# EAGLE design MotorDriver (EAGLE 7.3.0)
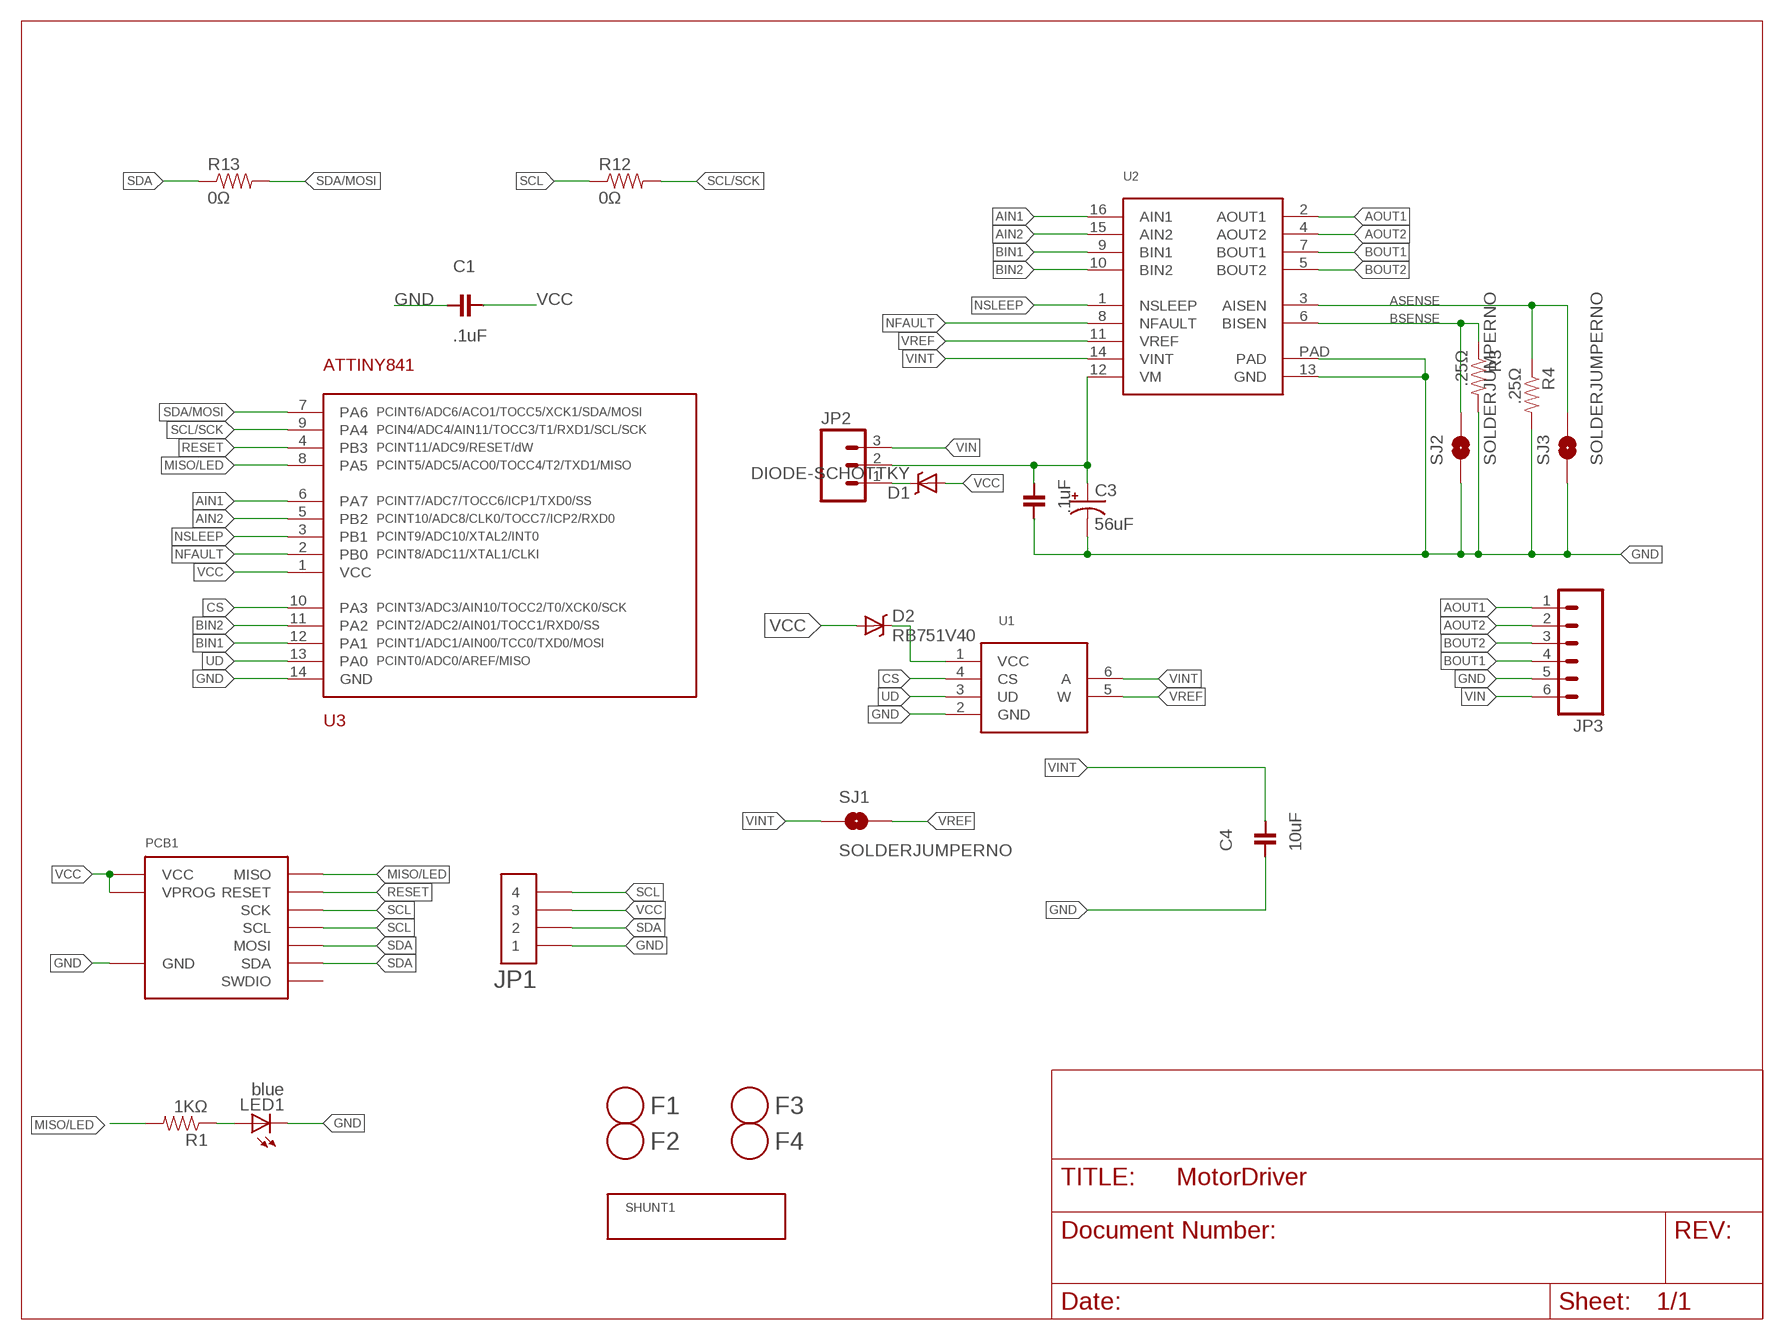
[diagram p0: schematic, sheet 1]
FRAME1 (LETTER_L): BOM: EXCLUDE
SHUNT1 (BOM_ITEM): PARTNUM: SPC02SYAN

## Parts
C1  .1uF  CAPACITOR-.1UF  [0603]
C2  .1uF  CAPACITOR-.1UF  [0603]
C3  56uF  CAPACITOR-POL-56UF-25V  [PANASONIC_D]
C4  10uF  CAPACITOR-10UF  [0603]
D1  DIODE-SCHOTTKY  [SMP]
D2  RB751V40  DIODE-SCHOTTKY-BAT60A  [SOD-323]
F1  FIDUCIAL  [FIDUCIAL_1MM]
F2  FIDUCIAL  [FIDUCIAL_1MM]
F3  FIDUCIAL  [FIDUCIAL_1MM]
F4  FIDUCIAL  [FIDUCIAL_1MM]
JP1  HEADER-1X4-AMPMODU  [AMPMODU-4P]
JP2  M03LOCK_NO_SILK  [1X03_LOCK_NO_SILK]
JP3  M063.5MM-6  [SCREWTERMINAL-3.5MM-6]
LED1  blue  LED-0805-BLUE  [0805-LED]
PCB1  DEVICE-PCB  [DEVICE-PCB]
R1  1KΩ  RESISTOR-1KΩ  [0603]
R3  .25Ω  RESISTOR2010  [R2010]
R4  .25Ω  RESISTOR2010  [R2010]
R12  0Ω  RESISTOR-0Ω  [0603]
R13  0Ω  RESISTOR-0Ω  [0603]
SJ1  SOLDERJUMPERNO  [SJ_2S-NO]
SJ2  SOLDERJUMPERNO  [SJ_2S-NO]
SJ3  SOLDERJUMPERNO  [SJ_2S-NO]
U1  MCP4013  [SOT-23-6]
U2  DRV8848  [HTSSOP-16]
U3  ATTINY841  [SOIC-14]

## Nets
AIN1: U2.16(AIN1) U3.6(PA7)
AIN2: U2.15(AIN2) U3.5(PB2)
AOUT1: JP3.1 U2.2(AOUT1)
AOUT2: JP3.2 U2.4(AOUT2)
ASENSE: R4.1 SJ3.2 U2.3(AISEN)
BIN1: U2.9(BIN1) U3.12(PA1)
BIN2: U2.10(BIN2) U3.11(PA2)
BOUT1: JP3.4 U2.7(BOUT1)
BOUT2: JP3.3 U2.5(BOUT2)
BSENSE: R3.1 SJ2.2 U2.6(BISEN)
CS: U1.4(CS) U3.10(PA3)
GND: C1.2 C2.2 C3.- C4.2 JP1.P$1 JP1.P$2 JP3.5 LED1.C PCB1.GND R3.2 R4.2 SJ2.1 SJ3.1 U1.2(GND) U2.13(GND) U2.PAD U3.14(GND)
MISO/LED: PCB1.MISO R1.2 U3.8(PA5)
N$1: D1.C JP2.1
N$2: D2.C U1.1(VCC)
N$7: LED1.A R1.1
N$10: C2.1 C3.+ JP2.2 U2.12(VM)
NFAULT: U2.8(NFAULT) U3.2(PB0)
NSLEEP: U2.1(NSLEEP) U3.3(PB1)
RESET: PCB1.RESET U3.4(PB3)
SCL: JP1.P$7 JP1.P$8 PCB1.CLK(SCK) PCB1.SCL R12.1
SCL/SCK: R12.2 U3.9(PA4)
SDA: JP1.P$3 JP1.P$4 PCB1.MOSI PCB1.SDA R13.1
SDA/MOSI: R13.2 U3.7(PA6)
UD: U1.3(UD) U3.13(PA0)
VCC: C1.1 D1.A D2.A JP1.P$5 JP1.P$6 PCB1.VCC PCB1.VPROG U3.1(VCC)
VIN: JP2.3 JP3.6
VINT: C4.1 SJ1.1 U1.6(A) U2.14(VINT)
VREF: SJ1.2 U1.5(W) U2.11(VREF)
Unconnected: PCB1.SWDIO

## Library data of the parts
C1 = Modulo:CAPACITOR: Capacitor; PARTNUM: C0603C104K5RACTU
C2 = Modulo:CAPACITOR: Capacitor; PARTNUM: C0603C104K5RACTU; RATING: >20V
C3 = Modulo:CAPACITOR-POL; PARTNUM: EMVA250ADA560MF55G; RATING: >20V
C4 = Modulo:CAPACITOR: Capacitor; PARTNUM: GRM188R61C106MA73D
D1 = Modulo:DIODE-SCHOTTKY; PARTNUM: SS3P3-M3/84A
D2 = Modulo:DIODE-SCHOTTKY; PARTNUM: RB751V40
F1-F4 = Modulo:FIDUCIAL; BOM: EXCLUDE
JP1 = Modulo:HEADER-1X4; PARTNUM: 147721-3
JP2 = SparkFun-Connectors:M03: Header 3 Standard 3-pin 0.1" header. Use with straight break away headers (SKU : PRT-00116), right angle break away headers (PRT-00553), swiss pins (PRT-00743), machine pins (PRT-00117), and female headers (PRT-00115). Molex polarized connector foot print use with SKU : PRT-08232 with associated crimp pins and housings.; PARTNUM: M20-9990346
JP3 = SparkFun-Connectors:M06: Header 6 Standard 6-pin 0.1" header. Use with straight break away headers (SKU : PRT-00116), right angle break away headers (PRT-00553), swiss pins (PRT-00743), machine pins (PRT-00117), and female headers (PRT-00115). Molex polarized connector foot print use with SKU : PRT-08094 with associated crimp pins and housings. NOTES ON THE VARIANTS LOCK and LOCK_LONGPADS... This footprint was designed to help hold the alignment of a through-hole component (i.e. 6-pin header) while soldering it into place. You may notice that each hole has been shifted either up or down by 0.005 of an inch from it's more standard position (which is a perfectly straight line). This slight alteration caused the pins (the squares in the middle) to touch the edges of the holes. Because they are alternating, it causes a "brace" to hold the component in place. 0.005 has proven to be the perfect amount of "off-center" position when using our standard breakaway headers. Although looks a little odd when you look at the bare footprint, once you have a header in there, the alteration is very hard to notice. Also,if you push a header all the way into place, it is covered up entirely on the bottom side. This idea of altering the position of holes to aid alignment will be further integrated into the Sparkfun Library for other footprints. It can help hold any component with 3 or more connection pins.; PARTNUM: OSTTE060104
LED1 = Modulo:LED: LED; PARTNUM: LTST-C171TBKT
PCB1 = Modulo:DEVICE-PCB: Modulo Footprint; PARTNUM: Motor Driver PCB
R1 = Modulo:RESISTOR: Resistor Basic schematic elements and footprints for 0603, 1206, and PTH resistors.; PARTNUM: ERJ-3EKF1001V
R3 R4 = SparkFun-Resistors:RESISTOR: Resistor Basic schematic elements and footprints for 0603, 1206, and PTH resistors.; PARTNUM: CSRN2010FKR250
R12 R13 = Modulo:RESISTOR: Resistor Basic schematic elements and footprints for 0603, 1206, and PTH resistors.; PARTNUM: ERJ-3GEY0R00V
SJ1-SJ3 = SparkFun-Passives:SOLDERJUMPER: Solder Jumper Standard SMD solder jumper. Used to automate production. Two varients : Normally Open and Normally Closed are the same, but have different paste layers. NC will have a large amount of paste and should jumper during reflow.; BOM: EXCLUDE
U1 = Modulo:MCP4013; PARTNUM: MCP4013T-503E/CH
U2 = Modulo:DRV8848; PARTNUM: DRV8848PWP
U3 = Modulo:ATTINY841; PARTNUM: ATTINY841-SSUR

## Board
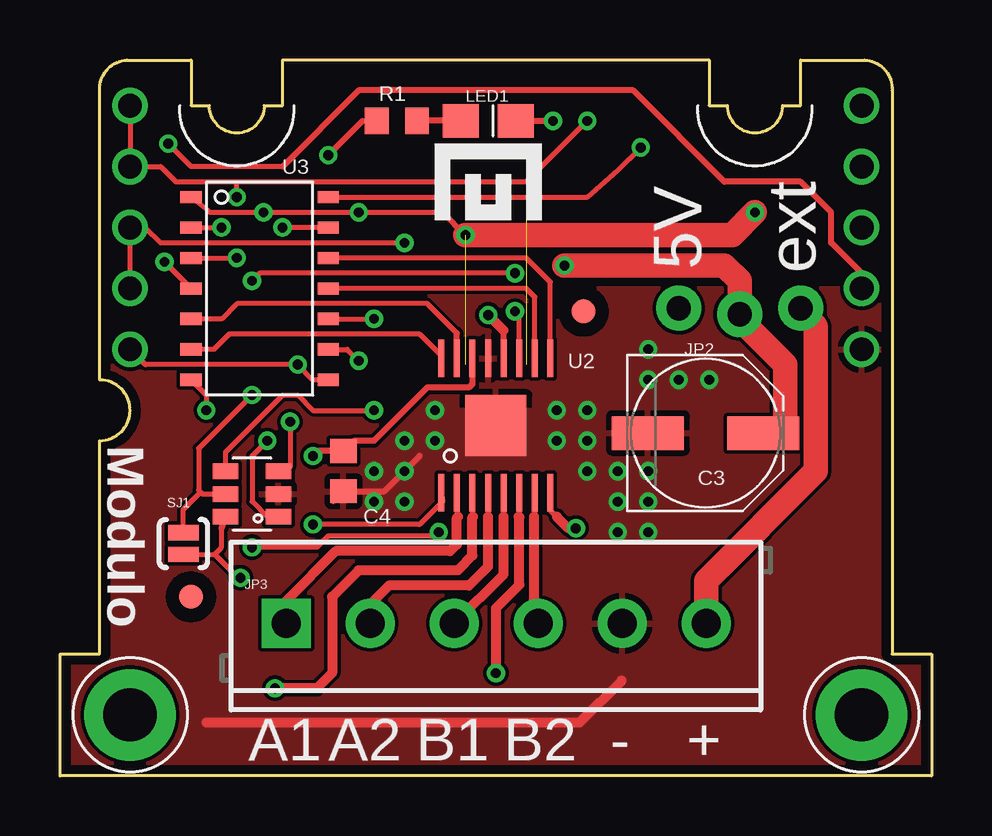
[diagram p1: board, top side]
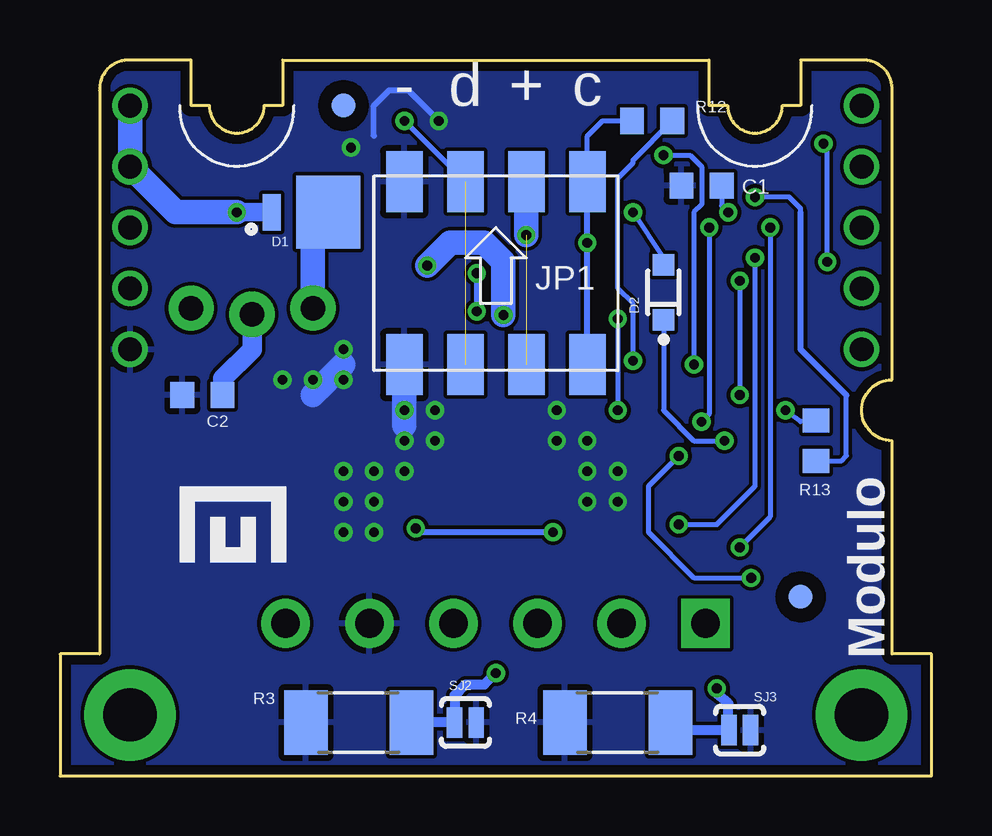
[diagram p2: board, bottom side, seen from below]

Size 36.32 x 29.84 mm. Coordinates in mm from the lower left corner, seen from the top.
Copper layers (1*16): Top 0.0356mm / dielectric 1.5011mm / Bottom 0.0356mm
Design rules "Modulo": minimum track width 6mil, minimum drill 13mil, track to track 6mil, track to pad 6mil, pad to pad 6mil, via to via 6mil, smd to smd 6mil, copper to edge 15mil, drill to drill 6mil, minimum pad ring 7mil, minimum via ring 7mil, stop-mask expansion 3mil, vias tented up to drill 25mil, thermal gap 10mil

### Footprints (pad centres in the part's own frame; a part is rotated, then mirrored left to right if it is on the bottom)
0603 = smd 0.991 x 1.092: 1 -0.838,0; 2 0.838,0
PANASONIC_D = smd 3 x 1.4: + 2.4,0; - -2.4,0
SMP = smd 0.762 x 1.524: A 2.349,0 | smd 2.667 x 3.048: C 0,0
SOD-323 = smd 0.9 x 0.9: A 1.15,0; C -1.15,0
FIDUCIAL_1MM = smd 1 x 1: 1 0,0
AMPMODU-4P = smd 1.524 x 2.54: P$1 -3.81,3.81; P$2 -3.81,-3.81; P$3 -1.27,3.81; P$4 -1.27,-3.81; P$5 1.27,3.81; P$6 1.27,-3.81; P$7 3.81,3.81; P$8 3.81,-3.81
1X03_LOCK_NO_SILK = drill 1.016 pad 1.88: 1 0,0.127; 2 2.54,-0.127; 3 5.08,0.127
SCREWTERMINAL-3.5MM-6 = drill 1.2 pad 2.032 square: 1 0,0 | drill 1.2 pad 2.032: 2 3.5,0; 3 7,0; 4 10.5,0; 5 14,0; 6 17.5,0
0805-LED = smd 1.397 x 1.499: A 0,-1.143; C 0,1.143
DEVICE-PCB = drill 0.991: CLK 2.54,20.32; GND 33.02,17.78; MISO 2.54,17.78; MOSI 2.54,25.4; RESET 33.02,20.32; SCL 2.54,22.86; SDA 2.54,27.94; SWDIO 33.02,22.86; VCC 33.02,25.4; VPROG 33.02,27.94 | drill 2.223 pad 3.81: P$1 2.54,2.54; P$2 33.02,2.54
R2010 = smd 1.8 x 2.7: 1 -2.2,0; 2 2.2,0
SJ_2S-NO = smd 0.635 x 1.27: 1 -0.45,0; 2 0.45,0
SOT-23-6 = smd 0.65 x 1.06: 1 -0.95,-1.1; 2 0,-1.1; 3 0.95,-1.1; 4 0.95,1.1; 5 0,1.1; 6 -0.95,1.1
HTSSOP-16 = smd 0.25 x 1.55: 1 -2.275,-2.8; 2 -1.625,-2.8; 3 -0.975,-2.8; 4 -0.325,-2.8; 5 0.325,-2.8; 6 0.975,-2.8; 7 1.625,-2.8; 8 2.275,-2.8; 9 2.275,2.8; 10 1.625,2.8; 11 0.975,2.8; 12 0.325,2.8; 13 -0.325,2.8; 14 -0.975,2.8; 15 -1.625,2.8; 16 -2.275,2.8 | smd 2.54 x 2.54: PAD 0,0
SOIC-14 = smd 0.508 x 0.889: 1 0,-3.175; 2 1.27,-3.175; 3 2.54,-3.175; 4 3.81,-3.175; 5 5.08,-3.175; 6 6.35,-3.175; 7 7.62,-3.175; 8 7.62,2.54; 9 6.35,2.54; 10 5.08,2.54; 11 3.81,2.54; 12 2.54,2.54; 13 1.27,2.54; 14 0,2.54

### Placement (x,y rotation side)
C1  9.59,24.61 180 bottom
C2  30.38,15.88 180 bottom
C3  26.89,14.29 0 top
C4  11.81,12.7 270 top
D1  25.15,23.5 180 bottom
D2  11.18,20.16 90 bottom
F1  24.51,27.94 0 bottom
F2  5.46,7.46 0 bottom
F3  5.46,7.46 0 top
F4  21.81,19.37 0 top
JP1  18.16,20.95 0 bottom
JP2  25.78,19.37 0 top
JP3  9.43,6.35 0 top
LED1  17.84,27.3 270 top
PCB1  0.38,0 0 top
R1  14.03,27.3 180 top
R3  23.88,2.22 180 bottom
R4  13.08,2.22 180 bottom
R12  11.65,27.3 0 bottom
R13  4.83,13.97 90 bottom
SJ1  5.14,9.68 90 top
SJ2  19.43,2.22 180 bottom
SJ3  8,1.91 180 bottom
U1  8,11.75 90 top
U2  18.16,14.61 0 top
U3  8.64,24.13 270 top
U$1  [LOGO-SMALL]  17.53,23.81 0 top
U$2  [LOGO-SMALL]  29.43,9.53 0 bottom

### Tracks (layer width: path | path; a pad name or v marks a point on that pad's centre or on a via)
AIN1
  Top 0.203: 15.89,17.52 14.99,18.41 7.05,18.41 6.41,17.78 U3.6
  Top 0.254: U2.16 15.89,17.52
AIN2
  Top 0.203: 16.54,18.45 15.3,19.68 7.37,19.68 6.73,19.05 U3.5
  Top 0.254: U2.15 16.54,18.45
AOUT1
  Top 0.203: U2.2 16.54,10.83 16.57,10.79
  Top 0.406: JP3.1 9.43,7.3 11.49,9.37 16.26,9.37 16.54,9.65 16.54,10.76 16.57,10.79
AOUT2
  Top 0.203: U2.4 17.84,10.8 17.84,10.79
  Top 0.406: JP3.2 12.92,5.72 12.92,7.14 13.72,7.94 17.05,7.94 17.84,8.72 17.84,10.79
ASENSE  (via drill 0.41)
  Top 0.203: U2.3 17.19,10.82 17.21,10.79
  Top 0.406: v8.95,3.65 10.7,3.65 11.34,4.29 11.34,7.46 12.45,8.57 16.57,8.57 17.19,9.19 17.19,10.77 17.21,10.79
  Bottom 0.406: R4.1 10.56,1.91 SJ3.2 8.48,3.02 9.09,3.52 v8.95,3.65
BIN1
  Top 0.203: U2.9 20.44,20.59 19.43,21.59 U3.12
BIN2
  Top 0.203: U2.10 19.79,19.96 19.43,20.32 U3.11
BOUT1
  Top 0.203: U2.7 19.79,10.83 19.75,10.79
  Top 0.406: 19.79,6.65 JP3.4 19.75,6.53 19.75,10.79
BOUT2
  Top 0.203: U2.5 18.49,10.8 18.48,10.79
  Top 0.406: JP3.3 18.49,8.41 18.49,10.79 18.48,10.79
BSENSE  (via drill 0.41)
  Top 0.203: U2.6 19.14,10.82 19.11,10.79
  Top 0.406: v18.16,4.29 18.16,6.99 19.14,7.96 19.14,10.77 19.11,10.79
  Bottom 0.406: R3.1 SJ2.2 19.88,3.36 19.43,3.81 18.64,3.81 v18.16,4.29
CS  (via drill 0.41)
  Top 0.203: U3.10 v13.08,19.05 | U1.4 6.9,13.51 9.27,15.88 9.91,15.88 10.54,15.24 v13.08,15.24
  Bottom 0.203: v13.08,19.05 v13.08,15.24
GND  (via drill 0.41)
  Top 0.203: U3.14 21.97,24.13 23.24,25.24 v24.19,26.19 | 11.38,11.43 C4.2
  Top 0.254: 17.84,13.66 U2.PAD | LED1.C v20.54,27.3 | C4.2 13.51,11.86 14.99,13.34
  Top 0.406: 6.1,2.22 21.65,2.22 23.4,3.97 | 23.4,5.68 JP3.5
  Bottom 0.254: 20.38,27.15 v20.54,27.3 21.81,28.57 22.61,28.57 23.24,27.94 23.24,26.67 | JP1.P$1 21.97,25.88 22.45,25.88
  Bottom 0.406: SJ3.1 7.53,2.22 | JP3.5 23.4,5.71
  Bottom 1.016: JP1.P$2 21.97,14.61 | 24.51,17.14 25.78,15.88
  other vias: 21.97,13.97 21.97,12.7 15.62,13.97 15.62,15.24 14.35,12.7 14.35,13.97 23.24,11.43 25.78,16.51 23.24,10.16 23.24,12.7 24.51,12.7 24.51,10.16 24.51,11.43 21.97,15.24 24.51,16.51 27.05,16.51 24.51,17.78 20.7,15.24 20.7,13.97 14.35,11.43 13.08,12.7 13.08,11.43
  pour Top: 37.21,-2.54 -0.89,-2.54 -0.89,20.32 37.21,20.32
  pour Bottom: 37.21,-2.54 37.21,29.84 -0.89,29.84 -0.89,-2.54
  pour Top (no thermals): 21.34,15.24 14.35,15.24 14.35,11.59 21.34,11.59
MISO/LED  (via drill 0.41)
  Top 0.203: U3.8 10.54,16.51 v9.91,17.14 3.56,17.14 PCB1.MISO | 12.61,27.3 R1.2
  Top 0.254: 12.61,27.3 v11.18,25.88
  Bottom 0.203: v11.18,25.88 10.06,25.88 9.59,25.4 9.59,23.81 9.91,23.5 v9.91,17.14
N$1
  Bottom 1.016: D1.C 25.78,22.86 JP2.1
N$2  (via drill 0.41)
  Top 0.203: v8.64,13.97 8,13.34 8,11.43 8.64,10.79 U1.1
  Bottom 0.203: D2.C 11.18,15.24 9.91,13.97 v8.64,13.97
N$7
  Top 0.254: LED1.A R1.1
N$10  (via drill 0.41)
  Top 0.254: U2.12 18.49,18.57
  Top 0.406: 18.49,18.57 v17.84,19.21
  Top 1.016: C3.+ 30.23,14.29 30.23,17.14 28.32,19.05 JP2.2 28.32,20.64 27.69,21.27 v21.02,21.27
  Bottom 0.406: 28.12,19.04 JP2.2
  Bottom 0.813: C2.1 29.55,16.55 28.32,17.78 28.32,19.05
  Bottom 1.016: v21.02,21.27 20.07,22.23 18.64,22.23 17.84,21.43 v17.84,19.21 | 28.32,19.05 28.12,19.04
NFAULT  (via drill 0.41)
  Top 0.203: U3.2 v6.73,22.86 | v15.78,10.16 15.46,10 11.18,10 10.7,9.53 v8,9.53 | U2.8 20.44,11.06 20.7,10.79
  Top 0.406: v21.5,10.32 21.18,10.32 20.7,10.79
  Bottom 0.203: v6.73,22.86 6.73,10.79 v8,9.53
  Bottom 0.254: v21.5,10.32 21.34,10.16 v15.78,10.16
NSLEEP  (via drill 0.41)
  Top 0.203: U2.1 15.94,11.43 14.99,10.48 10.7,10.48 10.6,10.54 v10.54,10.48 | U3.3 v7.37,21.59
  Bottom 0.203: v7.37,21.59 7.37,12.06 8.95,10.48 v10.54,10.48
RESET  (via drill 0.41)
  Top 0.203: 9.27,25.4 5.46,25.4 v4.51,26.35 | U3.4 v4.35,21.43
  Top 0.254: PCB1.RESET 33.4,20.95 32.13,22.23 32.13,23.5 30.86,24.77 27.69,24.77 23.88,28.57 12.45,28.57 9.27,25.4
  Bottom 0.203: v4.35,21.43 4.35,26.19
  Bottom 0.254: 4.35,26.19 v4.51,26.35
SCL  (via drill 0.41)
  Top 0.203: PCB1.CLK PCB1.SCL 3.56,22.86 4.19,22.23 v14.35,22.23
  Bottom 0.203: JP1.P$7 14.35,26.67 13.72,27.3 R12.1
  Bottom 0.254: JP1.P$8 v14.35,22.23 JP1.P$7
SCL/SCK  (via drill 0.41)
  Top 0.203: U3.9 11.97,17.78 v12.45,17.3
  Bottom 0.203: v12.45,17.3 12.45,19.68 13.08,20.32 13.08,24.92 12.45,25.56 12.45,25.67 R12.2
SDA  (via drill 0.41)  (1 unrouted)
  Top 0.203: PCB1.SDA PCB1.MOSI 4.19,25.4 4.83,24.77 7.37,24.77 | 7.37,24.77 JP1.P$3 v21.97,27.3 | v7.37,24.13 7.37,24.77
  Bottom 0.203: R13.1 3.76,13.13 3.56,13.34 3.56,15.88 | JP1.P$3 v21.97,27.3 | 5.46,23.5 5.46,23.65 5.94,24.13 v7.37,24.13
  Bottom 0.254: 5.46,23.5 5.46,17.78 3.56,15.88
SDA/MOSI  (via drill 0.41)
  Top 0.203: U3.7 6.1,15.88 v6.1,15.24
  Bottom 0.203: R13.2 5.46,14.76 v6.1,15.24
UD  (via drill 0.41)
  Top 0.203: U3.13 v9.27,22.86 | v9.59,14.76 9.59,12.87 U1.3
  Bottom 0.203: v9.27,22.86 9.27,15.08 v9.59,14.76
VCC  (via drill 0.41)  (1 unrouted)
  Top 0.203: U3.1 6.25,23.5 v8.48,23.5 v12.45,23.5 15.94,23.5
  Top 0.254: 15.94,23.5 v16.89,22.54
  Top 1.016: v16.89,22.54 28,22.54 v28.96,23.5
  Bottom 0.203: D2.A 11.18,21.59 v12.45,23.5 | C1.1 8.75,23.77 v8.48,23.5
  Bottom 0.762: v28.96,23.5 D1.A
  Bottom 1.016: v28.96,23.5 31.5,23.5 PCB1.VCC PCB1.VPROG | v16.89,22.54 JP1.P$5
VIN
  Top 1.016: JP3.6 26.93,8.13 31.5,12.7 31.5,18.73 JP2.3
VINT  (via drill 0.41)
  Top 0.203: SJ1.1 6.44,9.23 | 6.44,9.23 6.73,9.53 6.73,10.31 | v7.53,8.26 7.42,8.26 6.44,9.23
  Top 0.254: U2.14 17.19,16.33 17.05,16.19 15.3,16.19 13.08,13.97 12.24,13.97 C4.1 10.74,13.54 v10.54,13.34 | 6.73,10.31 U1.6
  Bottom 0.203: v10.54,13.34 11.81,12.06 11.81,10.16 9.91,8.26 v7.53,8.26
VREF  (via drill 0.41)
  Top 0.203: U2.11 19.14,19.19 v18.96,19.37 | v18.96,20.95 8.32,20.95 v8,20.64 | v8,15.88 5.78,13.65 5.78,11.91 5.86,11.83 | 5.86,11.83 5.94,11.75 U1.5 | SJ1.2 5.14,11.11 5.86,11.83
  Bottom 0.203: v18.96,19.37 v18.96,20.95 | v8,20.64 v8,15.88

### Text on the board
tPlace: 5V | ext | A1 | A2 | B1 | B2 | - | +